# Altium schematic sheet Auxiliary.SchDoc: main_assy PCB
size A4
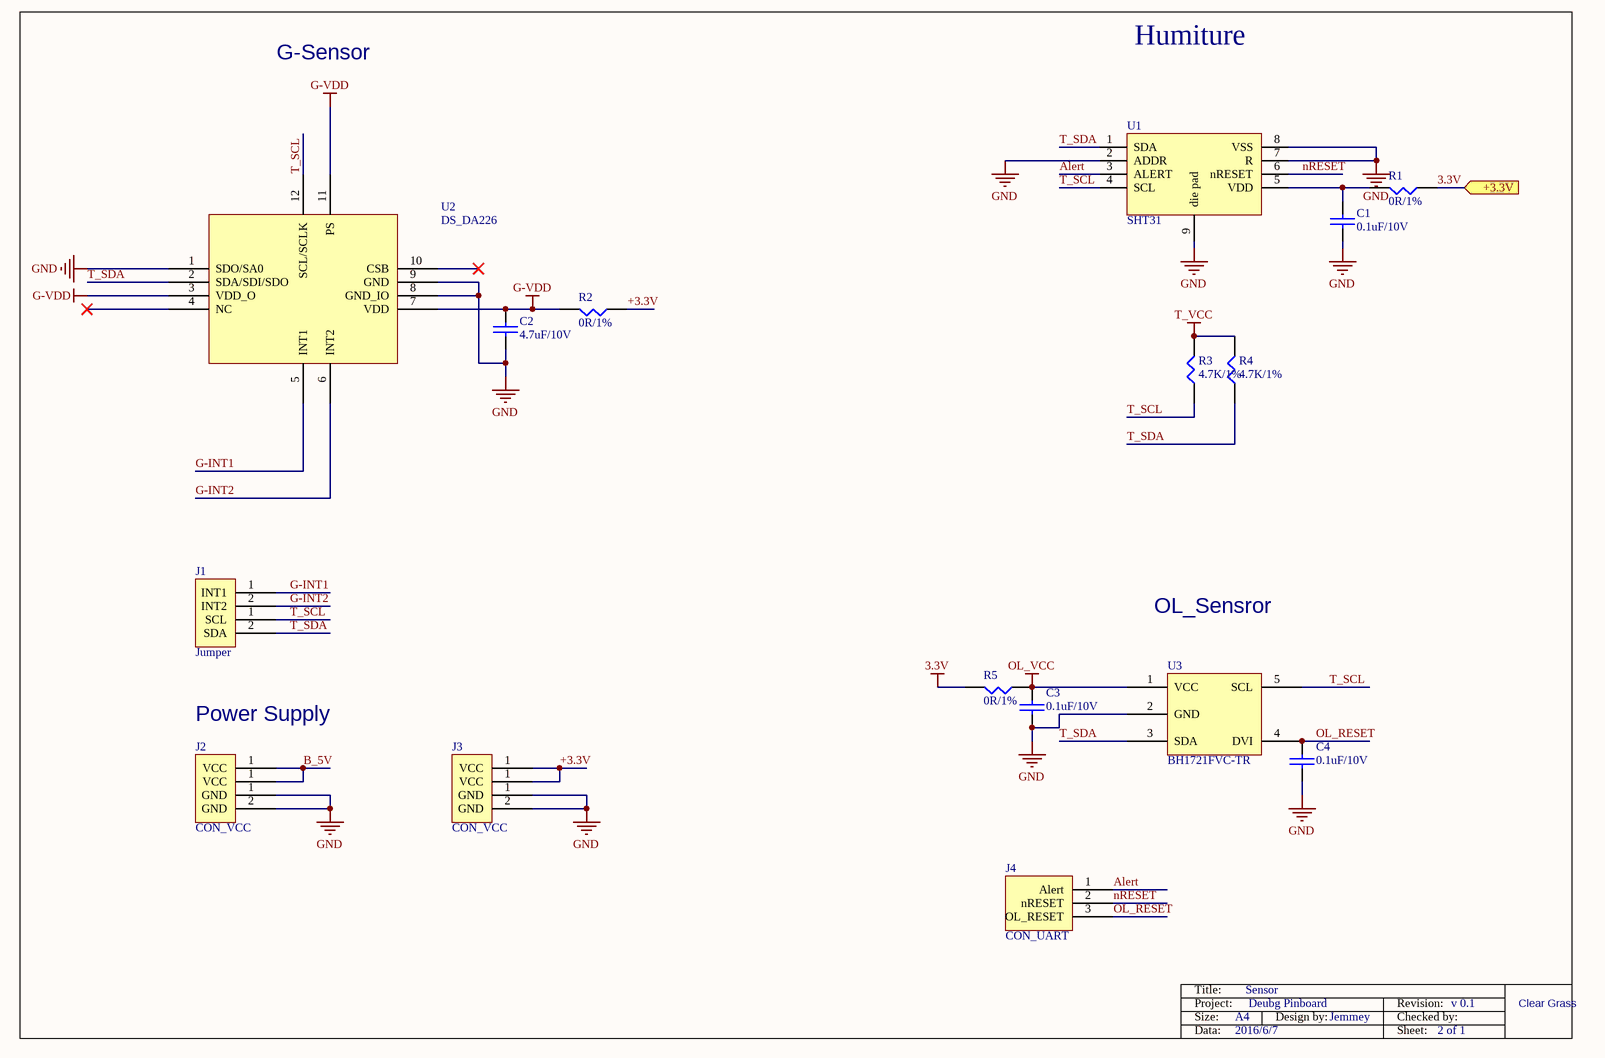
[diagram p0: Auxiliary.SchDoc]

## Parts
C1  0.1uF/10V  [0402C]
C2  4.7uF/10V  [0402C]
C3  0.1uF/10V  [0402C]
C4  0.1uF/10V  [0402C]
J1  Jumper
J2  CON_VCC
J3  CON_VCC
J4  CON_UART
R1  0R/1%  [0402R]
R2  0R/1%  [0402R]
R3  4.7K/1%  [0402R]
R4  4.7K/1%  [0402R]
R5  0R/1%  [0402R]
U1  SHT31  [DFN]
U2  DS_DA226
U3  BH1721FVC-TR  [WSOF5]

## Ports
+3.3V (in)

## Nets
3.3V: R1.1 R5.2 ; port +3.3V
G-VDD: C2.1 R2.2 U2.3(VDD_O) U2.7(VDD) U2.11(PS)
GND: C1.2 C2.2 C3.2 C4.2 J2.1(GND) J2.2(GND) J3.1(GND) J3.2(GND) U1.2(ADDR) U1.7(R) U1.8(VSS) U1.9(die_pad) U2.1(SDO/SA0) U2.8(GND_IO) U2.9(GND) U3.2(GND)
OL_VCC: C3.1 R5.1 U3.1(VCC)
T_VCC: R3.2 R4.2
+3.3V: J3.1(VCC) R2.1
Alert: J4.1(Alert) U1.3(ALERT)
B_5V: J2.1(VCC)
G-INT1: J1.1(INT1) U2.5(INT1)
G-INT2: J1.2(INT2) U2.6(INT2)
nRESET: J4.2(nRESET) U1.6(nRESET)
OL_RESET: C4.1 J4.3(OL_RESET) U3.4(DVI)
T_SCL: J1.1(SCL) R3.1 U1.4(SCL) U2.12(SCL/SCLK) U3.5(SCL)
T_SDA: J1.2(SDA) R4.1 U1.1(SDA) U2.2(SDA/SDI/SDO) U3.3(SDA)
NetC1_1: C1.1 R1.2 U1.5(VDD)

Not connected (* = marked no-connect by the designer): U2 4(NC)* 10(CSB)*

## Notes on the sheet
- Humiture
- G-Sensor
- OL_Sensror
- (near J2) Power Supply
- Title:
- Sensor
- Project:
- Size:
- Data:
- A4
- 2016/6/7
- Deubg Pinboard
- Design by:
- Jemmey
- Revision:
- Sheet:
- Checked by:
- 2 of 1
- v 0.1
- Clear Grass

## Library data of the parts
C1 C2 = CAP: 厂家：Murata，型号：GRM155R71A104KA01D
C3 C4 = CAP: 厂家：Murata，型号：
J1 = Jumper*4
R1-R5 = RES1: 厂家：Yageo，型号：RC0402FR-0710KL
U1 = SHT31: 厂家：盛思睿，型号：SHT31
U2 = LIS2DE12: 厂家：ST，型号：LIS2DH12